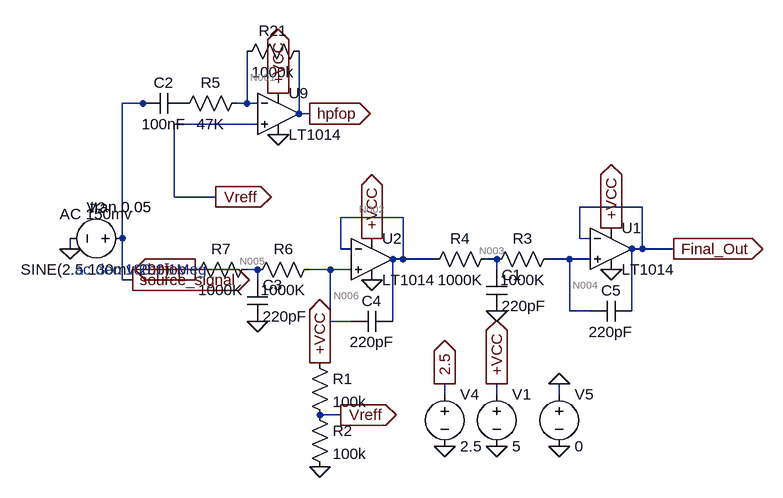
[diagram p0: schematic signal_amplifier.asc]
signal_amplifier.asc, the LTspice schematic file:
Version 4
SHEET 1 1972 1308
WIRE 352 -240 320 -240
WIRE 368 -240 352 -240
WIRE 512 -240 512 -320
WIRE 512 -240 496 -240
WIRE 528 -240 512 -240
WIRE 592 -224 592 -320
WIRE 608 -224 592 -224
WIRE 528 -208 400 -208
WIRE 400 -96 400 -208
WIRE 464 -96 400 -96
WIRE 1120 -80 1024 -80
WIRE 752 -64 656 -64
WIRE 320 -32 320 -240
WIRE 1024 -32 1024 -80
WIRE 1040 -32 1024 -32
WIRE 240 -16 240 -32
WIRE 656 -16 656 -64
WIRE 672 -16 656 -16
WIRE 1120 -16 1120 -80
WIRE 1120 -16 1104 -16
WIRE 1168 -16 1120 -16
WIRE 752 0 752 -64
WIRE 752 0 736 0
WIRE 800 0 752 0
WIRE 896 0 880 0
WIRE 1008 0 976 0
WIRE 1040 0 1008 0
WIRE 528 16 512 16
WIRE 640 16 608 16
WIRE 672 16 640 16
WIRE 896 16 896 0
WIRE 320 32 320 -32
WIRE 336 32 320 32
WIRE 528 32 528 16
WIRE 1008 80 1008 0
WIRE 1040 80 1008 80
WIRE 1104 80 1104 -16
WIRE 640 96 640 16
WIRE 672 96 640 96
WIRE 736 96 736 0
WIRE 816 208 816 192
WIRE 896 208 896 192
WIRE 992 208 992 192
WIRE 656 240 624 240
FLAG 896 192 +VCC
IOPIN 896 192 Out
FLAG 896 288 0
FLAG 624 320 0
FLAG 624 160 +VCC
IOPIN 624 160 Out
FLAG 656 240 Vreff
IOPIN 656 240 Out
FLAG 240 -16 0
FLAG 336 32 source_signal
IOPIN 336 32 Out
FLAG 816 288 0
FLAG 816 192 2.5
IOPIN 816 192 Out
FLAG 608 -224 hpfop
IOPIN 608 -224 Out
FLAG 560 -256 +VCC
IOPIN 560 -256 Out
FLAG 560 -192 0
FLAG 464 -96 Vreff
IOPIN 464 -96 Out
FLAG 704 -32 +VCC
IOPIN 704 -32 Out
FLAG 704 32 0
FLAG 528 96 0
FLAG 432 16 hpfop
IOPIN 432 16 Out
FLAG 1072 -48 +VCC
IOPIN 1072 -48 Out
FLAG 1072 16 0
FLAG 896 80 0
FLAG 1168 -16 Final_Out
IOPIN 1168 -16 Out
FLAG 992 288 0
FLAG 992 192 0
IOPIN 992 192 Out
SYMBOL voltage 896 192 R0
WINDOW 123 0 0 Left 0
WINDOW 39 0 0 Left 0
SYMATTR InstName V1
SYMATTR Value 5
SYMBOL res 608 144 R0
SYMATTR InstName R1
SYMATTR Value 100k
SYMBOL res 608 224 R0
SYMATTR InstName R2
SYMATTR Value 100k
SYMBOL voltage 336 -32 R90
WINDOW 0 -32 56 VBottom 2
WINDOW 3 32 56 VTop 2
WINDOW 123 -22 56 VBottom 2
WINDOW 39 0 0 Left 0
SYMATTR InstName V2
SYMATTR Value SINE(2.5 130mv 200)
SYMATTR Value2 AC 150mv
SYMBOL voltage 816 192 R0
WINDOW 123 0 0 Left 0
WINDOW 39 0 0 Left 0
SYMATTR InstName V4
SYMATTR Value 2.5
SYMBOL OpAmps\\LT1014 560 -288 R0
SYMATTR InstName U9
SYMBOL res 512 -256 R90
WINDOW 0 0 56 VBottom 2
WINDOW 3 32 56 VTop 2
SYMATTR InstName R5
SYMATTR Value 47K
SYMBOL res 608 -336 R90
WINDOW 0 0 56 VBottom 2
WINDOW 3 32 56 VTop 2
SYMATTR InstName R21
SYMATTR Value 1000k
SYMBOL cap 416 -256 R90
WINDOW 0 0 32 VBottom 2
WINDOW 3 32 32 VTop 2
SYMATTR InstName C2
SYMATTR Value 100nF
SYMBOL OpAmps\\LT1014 704 -64 R0
SYMATTR InstName U2
SYMBOL res 624 0 R90
WINDOW 0 0 56 VBottom 2
WINDOW 3 32 56 VTop 2
SYMATTR InstName R6
SYMATTR Value 1000K
SYMBOL res 416 32 R270
WINDOW 0 32 56 VTop 2
WINDOW 3 0 56 VBottom 2
SYMATTR InstName R7
SYMATTR Value 1000K
SYMATTR SpiceLine tol=1 pwr=0.1
SYMBOL cap 512 32 R0
SYMATTR InstName C3
SYMATTR Value 220pF
SYMBOL cap 736 80 R90
WINDOW 0 0 32 VBottom 2
WINDOW 3 32 32 VTop 2
SYMATTR InstName C4
SYMATTR Value 220pF
SYMBOL OpAmps\\LT1014 1072 -80 R0
SYMATTR InstName U1
SYMBOL res 992 -16 R90
WINDOW 0 0 56 VBottom 2
WINDOW 3 32 56 VTop 2
SYMATTR InstName R3
SYMATTR Value 1000K
SYMBOL res 784 16 R270
WINDOW 0 32 56 VTop 2
WINDOW 3 0 56 VBottom 2
SYMATTR InstName R4
SYMATTR Value 1000K
SYMATTR SpiceLine tol=1 pwr=0.1
SYMBOL cap 880 16 R0
SYMATTR InstName C1
SYMATTR Value 220pF
SYMBOL cap 1104 64 R90
WINDOW 0 0 32 VBottom 2
WINDOW 3 32 32 VTop 2
SYMATTR InstName C5
SYMATTR Value 220pF
SYMBOL voltage 992 192 R0
WINDOW 123 0 0 Left 0
WINDOW 39 0 0 Left 0
SYMATTR InstName V5
SYMATTR Value 0
TEXT 264 -80 Left 2 !.tran 0.05
TEXT 240 16 Left 2 ;.ac dec 100 1 1Meg

The netlist it stands for:
* signal_amplifier.asc
V1 +VCC 0 5
R1 +VCC Vreff 100k
R2 Vreff 0 100k
V2 source_signal 0 SINE(2.5 130mv 200) AC 150mv
V4 2.5 0 2.5
XU9 Vreff N001 +VCC 0 hpfop LT1014  ; pins In+ In- V+ V- OUT
R5 N001 P001 47K
R21 hpfop N001 1000k
C2 P001 source_signal 100nF
XU2 N006 N002 +VCC 0 N002 LT1014  ; pins In+ In- V+ V- OUT
R6 N006 N005 1000K
R7 hpfop N005 1000K tol=1 pwr=0.1
C3 N005 0 220pF
C4 N002 N006 220pF
XU1 N004 Final_Out +VCC 0 Final_Out LT1014  ; pins In+ In- V+ V- OUT
R3 N004 N003 1000K
R4 N002 N003 1000K tol=1 pwr=0.1
C1 N003 0 220pF
C5 Final_Out N004 220pF
V5 0 0 0
.tran 0.05
* .ac dec 100 1 1Meg
.backanno
.end

* Results of the author's LTspice run, read from the files saved beside the schematic
* Operating Point, zero values left out:
*   V(+vcc) = 5 V
*   V(vreff) = 2.501 V
*   V(source_signal) = 2.5 V
*   V(2.5) = 2.5 V
*   V(n001) = 2.501 V
*   V(hpfop) = 2.489 V
*   V(p001) = 2.501 V
*   V(n002) = 2.513 V
*   V(n006) = 2.513 V
*   V(n005) = 2.501 V
*   V(final_out) = 2.537 V
*   V(n004) = 2.537 V
*   V(n003) = 2.525 V
*   I(R1) = 24.99 µA
*   I(R2) = 25.01 µA
*   I(R21) = -12 nA
*   I(R6) = 12 nA
*   I(R7) = -12 nA
*   I(R3) = 12 nA
*   I(R4) = -12 nA
*   I(V1) = -1.075 mA
*   Ix(u9:1) = -12 nA
*   Ix(u9:2) = -12 nA
*   Ix(u9:3) = 350 µA
*   Ix(u9:4) = -350 µA
*   Ix(u9:5) = 24 nA
*   Ix(u2:1) = -12 nA
*   Ix(u2:2) = -12 nA
*   Ix(u2:3) = 350 µA
*   Ix(u2:4) = -350 µA
*   Ix(u2:5) = 24 nA
*   Ix(u1:1) = -12 nA
*   Ix(u1:2) = -12 nA
*   Ix(u1:3) = 350 µA
*   Ix(u1:4) = -350 µA
*   Ix(u1:5) = 12 nA